# Altium schematic sheet Motors.SchDoc
size A4; SheetNumber: 4; SheetTotal: 10
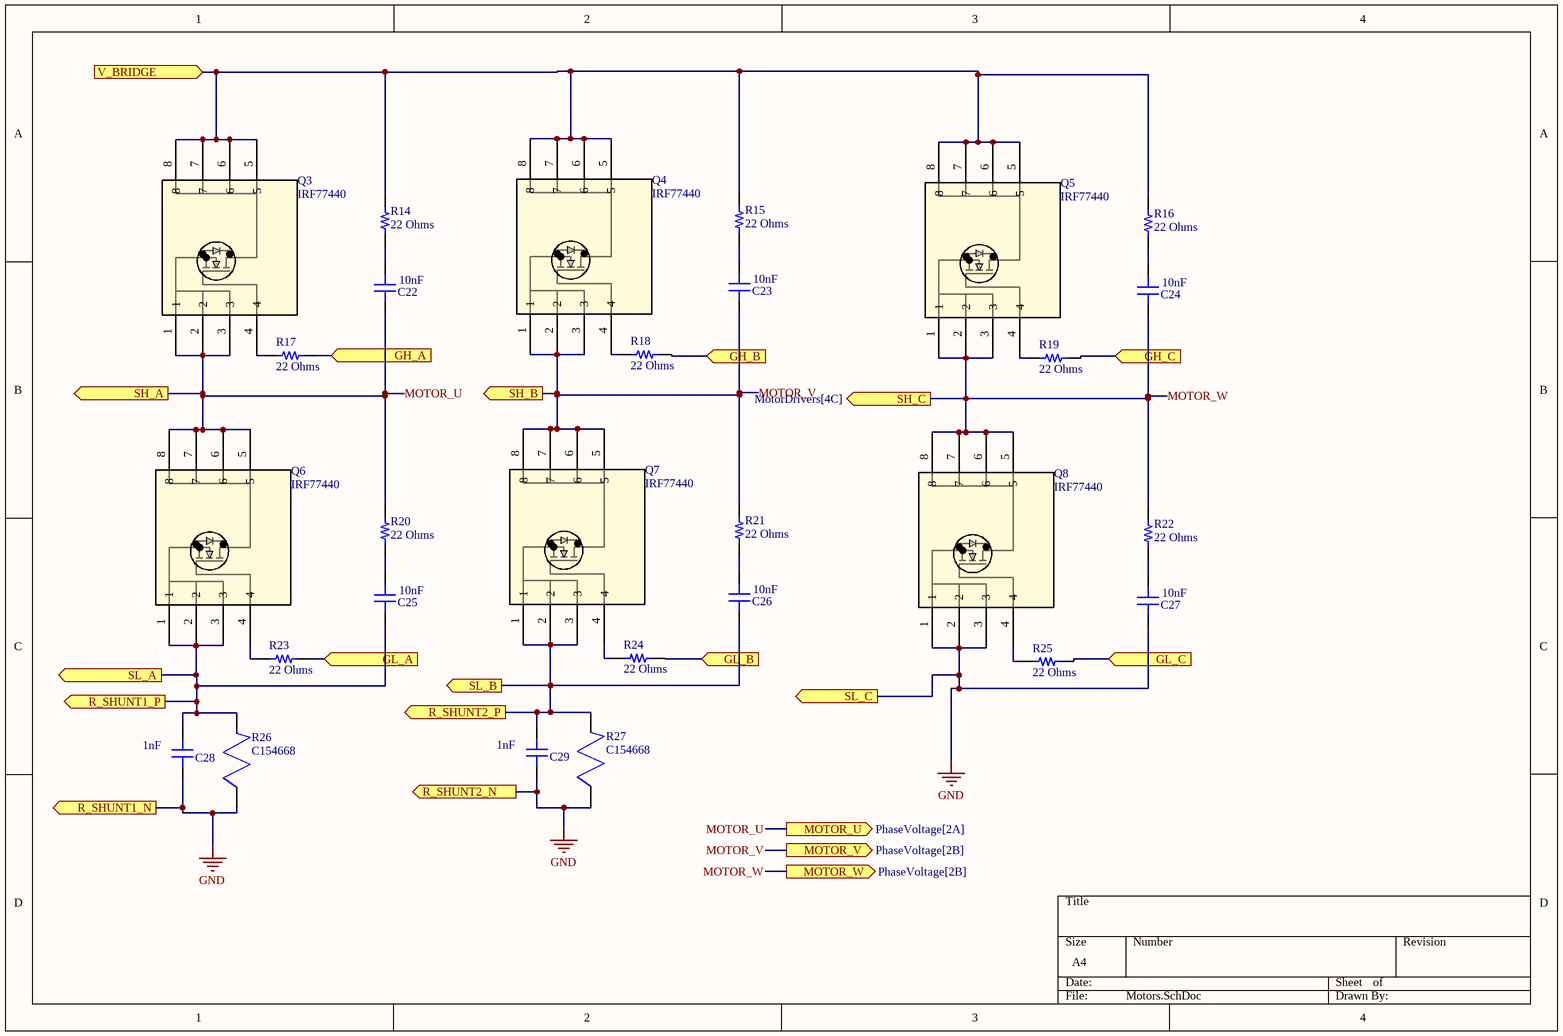
[diagram p0: Motors.SchDoc]

## Parts
C22  10nF  [CAP 0603_1608]
C23  10nF  [CAP 0603_1608]
C24  10nF  [CAP 0603_1608]
C25  10nF  [CAP 0603_1608]
C26  10nF  [CAP 0603_1608]
C27  10nF  [CAP 0603_1608]
C28  1nF  [CAP 0603_1608]
C29  1nF  [CAP 0603_1608]
Q3  IRF77440  [IRF77440]
Q4  IRF77440  [IRF77440]
Q5  IRF77440  [IRF77440]
Q6  IRF77440  [IRF77440]
Q7  IRF77440  [IRF77440]
Q8  IRF77440  [IRF77440]
R14  22 Ohms  [RES 0402_1005]
R15  22 Ohms  [RES 0402_1005]
R16  22 Ohms  [RES 0402_1005]
R17  22 Ohms  [RES 0402_1005]
R18  22 Ohms  [RES 0402_1005]
R19  22 Ohms  [RES 0402_1005]
R20  22 Ohms  [RES 0402_1005]
R21  22 Ohms  [RES 0402_1005]
R22  22 Ohms  [RES 0402_1005]
R23  22 Ohms  [RES 0402_1005]
R24  22 Ohms  [RES 0402_1005]
R25  22 Ohms  [RES 0402_1005]
R26  C154668  [C154668]
R27  C154668  [C154668]

## Ports
GH_A (in, see MotorDrivers[4A]), GH_B (in, see MotorDrivers[4A]), GH_C (in, see MotorDrivers[4B]), GL_A (in, see MotorDrivers[4A]), GL_B (in, see MotorDrivers[4A]), GL_C (in, see MotorDrivers[4B]), MOTOR_U (out, see PhaseVoltage[2A]), MOTOR_V (out, see PhaseVoltage[2B]), MOTOR_W (out, see PhaseVoltage[2B]), R_SHUNT1_N (out, see MotorDrivers[4B]), R_SHUNT1_P (out, see MotorDrivers[4B]), R_SHUNT2_N (out, see MotorDrivers[4B]), R_SHUNT2_P (out, see MotorDrivers[4B]), SH_A (out, see MotorDrivers[4B]), SH_B (out, see MotorDrivers[4C]), SH_C (out, see MotorDrivers[4C]), SL_A (out, see MotorDrivers[4A]), SL_B (out, see MotorDrivers[4B]), SL_C (out, see MotorDrivers[3B]), V_BRIDGE (in, see DC-DC_Buck_Converter+12Vto+3.3V[1A], DC_Current_Voltage_Measurement[3B], MotorDrivers[3C], Power[4A])

## Nets
GND: C27.1 C28.1 C29.1 Q8.1 Q8.2 Q8.3 R26.1 R27.1 ; port R_SHUNT1_N, port R_SHUNT2_N, port SL_C
GH_A: R17.2 ; port GH_A
GH_B: R18.2 ; port GH_B
GH_C: R19.2 ; port GH_C
GL_A: R23.2 ; port GL_A
GL_B: R24.2 ; port GL_B
GL_C: R25.2 ; port GL_C
MOTOR_U: C22.1 Q3.1 Q3.2 Q3.3 Q6.5 Q6.6 Q6.7 Q6.8 R20.2 ; port SH_A, port MOTOR_U
MOTOR_V: C23.1 Q4.1 Q4.2 Q4.3 Q7.5 Q7.6 Q7.7 Q7.8 R21.2 ; port SH_B, port MOTOR_V
MOTOR_W: C24.1 Q5.1 Q5.2 Q5.3 Q8.5 Q8.6 Q8.7 Q8.8 R22.2 ; port SH_C, port MOTOR_W
R_SHUNT1_P: C25.1 C28.2 Q6.1 Q6.2 Q6.3 R26.2 ; port R_SHUNT1_P, port SL_A
R_SHUNT2_P: C26.1 C29.2 Q7.1 Q7.2 Q7.3 R27.2 ; port R_SHUNT2_P, port SL_B
V_BRIDGE: Q3.5 Q3.6 Q3.7 Q3.8 Q4.5 Q4.6 Q4.7 Q4.8 Q5.5 Q5.6 Q5.7 Q5.8 R14.2 R15.2 R16.2 ; port V_BRIDGE
NetC22_2: C22.2 R14.1
NetC23_2: C23.2 R15.1
NetC24_2: C24.2 R16.1
NetC25_2: C25.2 R20.1
NetC26_2: C26.2 R21.1
NetC27_2: C27.2 R22.1
NetQ3_4: Q3.4 R17.1
NetQ4_4: Q4.4 R18.1
NetQ5_4: Q5.4 R19.1
NetQ6_4: Q6.4 R23.1
NetQ7_4: Q7.4 R24.1
NetQ8_4: Q8.4 R25.1

## Library data of the parts
C22-C29 = 0603ZC102KAT2A: CAP CER 1000PF 10V X7R 0603; manufacturer: AVX Corporation; Tolerance: ±10%; Part Number: 0603ZC102KAT2A; Applications: General Purpose; componentlink1description: Datasheet; componentlink1url: http://datasheets.avx.com/X7RDielectric.pdf; componentlink2description: DigiKey Link; componentlink2url: http://digikey.com/product-detail/en/avx-corporation/0603ZC102KAT2A/478-0603ZC102KAT2ACT-ND/11570315; Device Package: 0603 (1608 Metric); lastupdated: 2.09.2020 01:02:55; Lifecycle Status: Active; Minimum Order: 1; Mounting Type: Surface Mount, MLCC; Operating Temperature: -55°C ~ 125°C; Package / Case: 0603 (1608 Metric); packaging: TapeAndReel; partid: 27370; Part Status: Active; price: 0.01; series: -; Supplier 1: DigiKey; Supplier Part Number 1: 478-0603ZC102KAT2ACT-ND; Temperature Coefficient: X7R; Voltage - Rated: 10V
  C22-C27: Value: 10nF; Capacitance: 10nF
  C28 C29: Value: 1nF; Capacitance: 1nF
R14-R25 = ESR01MZPF47R0: ANTI-SURGE CHIP RESISTORS; Manufacturer: Rohm Semiconductor; Power (Watts): 0.2W, 1/5W; Temperature Coefficient: ±100ppm/°C; Tolerance: ±1%; Part Number: ESR01MZPF47R0; Value: 22 Ohms; ComponentLink1Description: Datasheet; ComponentLink1URL: https://fscdn.rohm.com/en/products/databook/datasheet/passive/resistor/chip_resistor/esr-e.pdf; ComponentLink2Description: DigiKey Link; ComponentLink2URL: https://www.digikey.com/en/products/detail/rohm-semiconductor/ESR01MZPF47R0/16180187; Composition: Thick Film; Device Package: 0402 (1005 Metric); Features: Automotive AEC-Q200, Pulse Withstanding; Height - Seated (Max): 0.016" (0.40mm); LastUpdated: 5.10.2023 19:23:22; Lifecycle Status: Active; Minimum Order: 1; Number of Terminations: 2; Operating Temperature: -55°C ~ 155°C; Package / Case: 0402 (1005 Metric); Packaging: TapeAndReel; PartId: 67421; Part Status: Active; Price: 0.03; Ratings: AEC-Q200; Resistance: 22 Ohms; Series: ESR; Size / Dimension: 0.039" L x 0.020" W (1.00mm x 0.50mm); Supplier 1: DigiKey; Supplier Part Number 1: 511-ESR01MZPF47R0CT-ND; Supplier Device Package: 0402